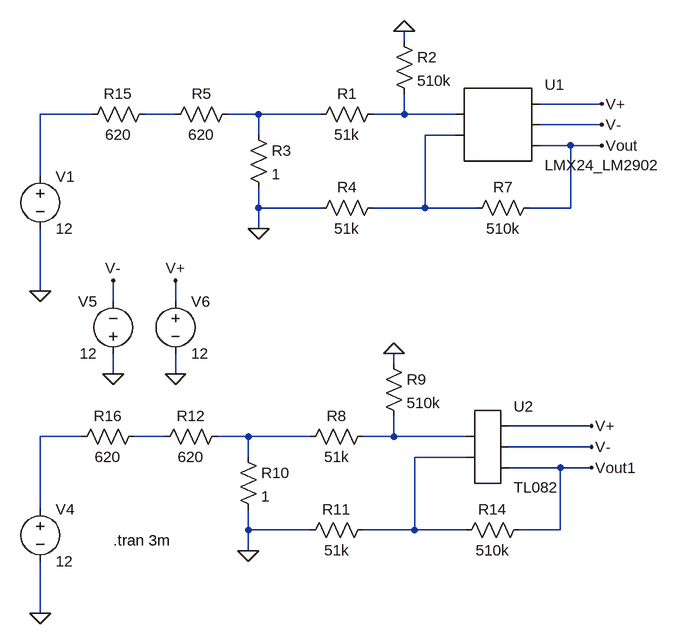
[diagram p0: schematic Draft2.asc]
Draft2.asc, the LTspice schematic file:
Version 4
SHEET 1 880 984
WIRE 272 64 272 48
WIRE 576 160 480 160
WIRE -208 176 -288 176
WIRE -80 176 -128 176
WIRE 48 176 0 176
WIRE 144 176 48 176
WIRE 272 176 272 144
WIRE 272 176 224 176
WIRE 352 176 272 176
WIRE 576 192 480 192
WIRE 48 208 48 176
WIRE 352 208 304 208
WIRE 528 224 480 224
WIRE 576 224 528 224
WIRE -288 272 -288 176
WIRE 48 320 48 288
WIRE 144 320 48 320
WIRE 304 320 304 208
WIRE 304 320 224 320
WIRE 384 320 304 320
WIRE 528 320 528 224
WIRE 528 320 464 320
WIRE 48 352 48 320
WIRE -288 448 -288 352
WIRE -176 464 -176 432
WIRE -80 464 -80 432
WIRE 256 560 256 544
WIRE -176 576 -176 544
WIRE -80 576 -80 544
WIRE 560 656 432 656
WIRE -224 672 -288 672
WIRE -96 672 -144 672
WIRE 32 672 -16 672
WIRE 128 672 32 672
WIRE 256 672 256 640
WIRE 256 672 208 672
WIRE 368 672 256 672
WIRE 560 688 432 688
WIRE 32 704 32 672
WIRE 368 704 288 704
WIRE 512 720 432 720
WIRE 560 720 512 720
WIRE -288 784 -288 672
WIRE 32 816 32 784
WIRE 128 816 32 816
WIRE 288 816 288 704
WIRE 288 816 208 816
WIRE 368 816 288 816
WIRE 512 816 512 720
WIRE 512 816 448 816
WIRE 32 848 32 816
WIRE -288 944 -288 864
FLAG 272 48 0
FLAG 576 224 Vout
FLAG 576 192 V-
FLAG 576 160 V+
FLAG -288 448 0
FLAG 256 544 0
FLAG 560 720 Vout1
FLAG 560 688 V-
FLAG 560 656 V+
FLAG -288 944 0
FLAG -80 576 0
FLAG -176 576 0
FLAG -176 432 V-
FLAG -80 432 V+
FLAG 48 352 0
FLAG 32 848 0
SYMBOL res 240 160 R90
WINDOW 0 0 56 VBottom 2
WINDOW 3 32 56 VTop 2
SYMATTR InstName R1
SYMATTR Value 51k
SYMBOL res 256 48 R0
SYMATTR InstName R2
SYMATTR Value 510k
SYMBOL res 32 192 R0
SYMATTR InstName R3
SYMATTR Value 1
SYMBOL res 240 304 R90
WINDOW 0 0 56 VBottom 2
WINDOW 3 32 56 VTop 2
SYMATTR InstName R4
SYMATTR Value 51k
SYMBOL res 16 160 R90
WINDOW 0 0 56 VBottom 2
WINDOW 3 32 56 VTop 2
SYMATTR InstName R5
SYMATTR Value 620
SYMBOL res 368 336 R270
WINDOW 0 32 56 VTop 2
WINDOW 3 0 56 VBottom 2
SYMATTR InstName R7
SYMATTR Value 510k
SYMBOL AutoGenerated\\LMX24_LM2902 416 192 R0
SYMATTR InstName U1
SYMBOL voltage -288 256 R0
WINDOW 123 0 0 Left 0
WINDOW 39 0 0 Left 0
SYMATTR InstName V1
SYMATTR Value 12
SYMBOL res 224 656 R90
WINDOW 0 0 56 VBottom 2
WINDOW 3 32 56 VTop 2
SYMATTR InstName R8
SYMATTR Value 51k
SYMBOL res 240 544 R0
SYMATTR InstName R9
SYMATTR Value 510k
SYMBOL res 16 688 R0
SYMATTR InstName R10
SYMATTR Value 1
SYMBOL res 224 800 R90
WINDOW 0 0 56 VBottom 2
WINDOW 3 32 56 VTop 2
SYMATTR InstName R11
SYMATTR Value 51k
SYMBOL res 0 656 R90
WINDOW 0 0 56 VBottom 2
WINDOW 3 32 56 VTop 2
SYMATTR InstName R12
SYMATTR Value 620
SYMBOL res 352 832 R270
WINDOW 0 32 56 VTop 2
WINDOW 3 0 56 VBottom 2
SYMATTR InstName R14
SYMATTR Value 510k
SYMBOL voltage -288 768 R0
WINDOW 123 0 0 Left 0
WINDOW 39 0 0 Left 0
SYMATTR InstName V4
SYMATTR Value 12
SYMBOL voltage -176 560 R180
WINDOW 0 24 96 Left 2
WINDOW 3 24 16 Left 2
WINDOW 123 0 0 Left 0
WINDOW 39 0 0 Left 0
SYMATTR InstName V5
SYMATTR Value 12
SYMBOL voltage -80 448 R0
WINDOW 123 0 0 Left 0
WINDOW 39 0 0 Left 0
SYMATTR InstName V6
SYMATTR Value 12
SYMBOL AutoGenerated\\TL082 400 688 R0
SYMATTR InstName U2
SYMBOL res -112 160 R90
WINDOW 0 0 56 VBottom 2
WINDOW 3 32 56 VTop 2
SYMATTR InstName R15
SYMATTR Value 620
SYMBOL res -128 656 R90
WINDOW 0 0 56 VBottom 2
WINDOW 3 32 56 VTop 2
SYMATTR InstName R16
SYMATTR Value 620
TEXT -176 832 Left 2 !.tran 3m

The netlist it stands for:
* Draft2.asc
R1 N004 N003 51k
R2 0 N004 510k
R3 N003 0 1
R4 N005 0 51k
R5 N003 N002 620
R7 N005 Vout 510k
* U1: LMX24_LM2902 (symbol AutoGenerated\LMX24_LM2902 not available, pins judged from their places): pin1=N004 pin2=N005 pin3=V+ pin4=V- pin5=Vout
V1 N001 0 12
R8 N009 N008 51k
R9 0 N009 510k
R10 N008 0 1
R11 N010 0 51k
R12 N008 N007 620
R14 N010 Vout1 510k
V4 N006 0 12
V5 0 V- 12
V6 V+ 0 12
* U2: TL082 (symbol AutoGenerated\TL082 not available, pins judged from their places): pin1=N009 pin2=N010 pin3=V+ pin4=V- pin5=Vout1
R15 N002 N001 620
R16 N007 N006 620
.tran 3m
.backanno
.end